# EAGLE design EVsim (EAGLE 5.11)
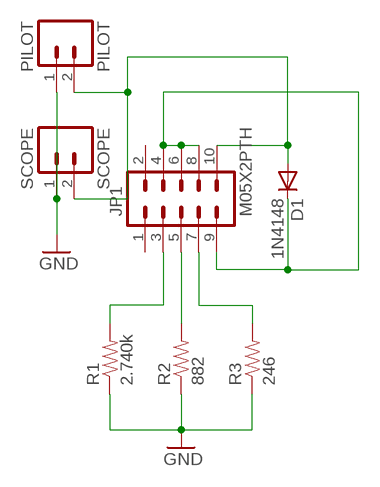
[diagram p0: schematic, sheet 1]

## Parts
D1  1N4148  DIODE1N4148  [DIODE-1N4148]
JP1  M05X2PTH  [AVR_ICSP]
PILOT  PILOT  M02LOCK  [1X02_LOCK]
R1  2.740k  RESISTORPTH-1/4W  [AXIAL-0.4]
R2  882  RESISTORPTH-1/4W  [AXIAL-0.4]
R3  246  RESISTORPTH-1/4W  [AXIAL-0.4]
SCOPE  SCOPE  M02LOCK  [1X02_LOCK]

## Nets
GND: PILOT.1 R1.P$1 R2.P$1 R3.P$1 SCOPE.1
N$2: D1.C JP1.4 JP1.6 JP1.8 JP1.9
N$3: JP1.3 R1.P$2
N$4: JP1.5 R2.P$2
N$5: JP1.7 R3.P$2
SCOPE: D1.A JP1.10 PILOT.2 SCOPE.2
Unconnected: JP1.1 JP1.2

## Library data of the parts
D1 = SparkFun:DIODE: Diode These are standard reverse protection diodes and small signal diodes. SMA package can handle up to about 1A. SOD-323 can handle about 200mA. What the SOD-323 package when ordering, there are some mfgs out there that are 5-pin packages.
JP1 = SparkFun:M05X2: Header 5x2 Standard 10-pin dual row 0.1" header. Commonly used with AVR-ISP. Use with Spark Fun Electronics SKU: PRT-00778
PILOT SCOPE = SparkFun:M02: Header 2 Standard 2-pin 0.1" header. Use with straight break away headers (SKU : PRT-00116), right angle break away headers (PRT-00553), swiss pins (PRT-00743), machine pins (PRT-00117), and female headers (PRT-00115). Molex polarized connector foot print use with SKU : PRT-08233 with associated crimp pins and housings.
R1-R3 = SparkFun:RESISTOR: Resistor Basic schematic elements and footprints for 0603, 1206, and PTH resistors.

## Board
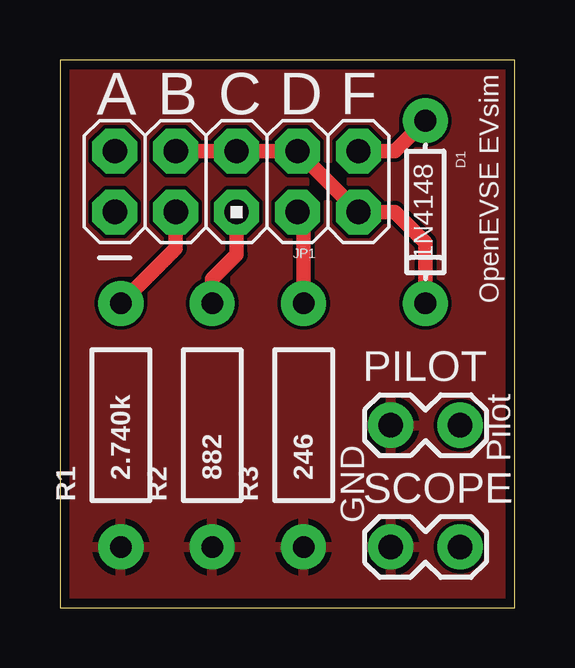
[diagram p1: board, top side]
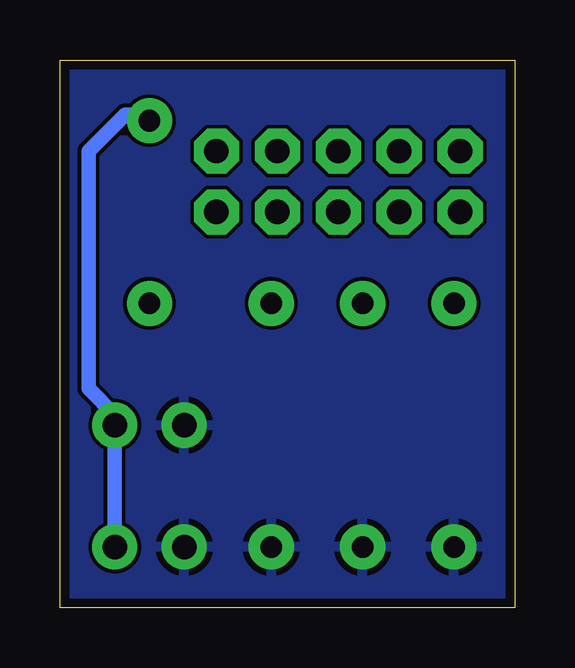
[diagram p2: board, bottom side, seen from below]

Size 18.97 x 22.85 mm. Coordinates in mm from the lower left corner, seen from the top.
Outline: 0,0 18.97,0 18.97,22.85 0,22.85 0,0
Copper layers (1*16): Top 0.0356mm / dielectric 1.5011mm / Bottom 0.0356mm
Design rules "LaenPCBOrder": minimum track width 6mil, minimum drill 13mil, track to track 6mil, track to pad 6mil, pad to pad 6mil, via to via 6mil, smd to smd 6mil, copper to edge 15mil, drill to drill 6mil, minimum pad ring 7mil, minimum via ring 7mil, stop-mask expansion 4mil, vias tented up to drill 0mil, thermal gap 10mil

### Footprints (pad centres in the part's own frame; a part is rotated, then mirrored left to right if it is on the bottom)
DIODE-1N4148 = drill 0.9 pad 1.88 round: A -3.81,0; C 3.81,0
AVR_ICSP = drill 1.016 pad 1.88 octagon: 1 -1.27,5.08; 2 1.27,5.08; 3 -1.27,2.54; 4 1.27,2.54; 5 -1.27,0; 6 1.27,0; 7 -1.27,-2.54; 8 1.27,-2.54; 9 -1.27,-5.08; 10 1.27,-5.08
1X02_LOCK = drill 1.016 pad 1.88 round: 1 -0.178,0; 2 2.718,0
AXIAL-0.4 = drill 0.9 pad 1.88 round: P$1 -5.08,0; P$2 5.08,0

### Placement (x,y rotation side)
D1  15.24,16.51 270 top
JP1  7.37,17.78 90 top
PILOT  13.97,7.62 0 top
R1  2.54,7.62 90 top
R2  6.35,7.62 90 top
R3  10.16,7.62 90 top
SCOPE  13.97,2.54 0 top

### Tracks (layer width: path | path; a pad name or v marks a point on that pad's centre or on a via)
GND
  pour Top: -3.81,27.94 22.86,27.94 22.86,-2.54 -3.81,-2.54
  pour Bottom: -5.08,30.48 25.4,30.48 25.4,-5.08 -5.08,-5.08
N$2
  Top 0.61: D1.C 15.24,15.24 13.97,16.51 JP1.9 JP1.8 JP1.6 JP1.4
N$3
  Top 0.61: R1.P$2 4.83,14.99 JP1.3
N$4
  Top 0.61: R2.P$2 6.35,13.72 7.37,14.73 JP1.5
N$5
  Top 0.61: R3.P$2 10.16,16.26 JP1.7
SCOPE
  Top 0.61: D1.A 13.97,19.05 JP1.10
  Bottom 0.61: SCOPE.2 PILOT.2 16.69,8.05 17.78,9.14 17.78,19.05 16.26,20.57 15.49,20.57 D1.A

### Text on the board
tNames: A | B | C | D | F | OpenEVSE EVsim | Pilot | GND